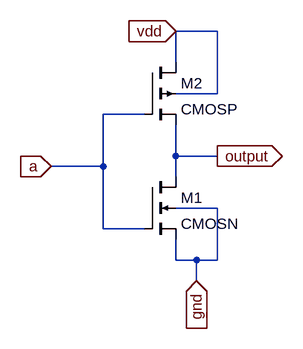
[diagram p0: schematic inveter.asc]
inveter.asc, the LTspice schematic file:
Version 4
SHEET 1 880 680
WIRE -16 -240 -80 -240
WIRE -80 -192 -80 -240
WIRE -16 -144 -16 -240
WIRE -16 -144 -80 -144
WIRE -128 -112 -192 -112
WIRE -80 -48 -80 -96
WIRE -16 -48 -80 -48
WIRE -192 -32 -192 -112
WIRE -192 -32 -272 -32
WIRE -80 -16 -80 -48
WIRE -16 32 -80 32
WIRE -192 64 -192 -32
WIRE -128 64 -192 64
WIRE -80 112 -80 80
WIRE -48 112 -80 112
WIRE -16 112 -16 32
WIRE -16 112 -48 112
WIRE -48 144 -48 112
FLAG -272 -32 a
IOPIN -272 -32 In
FLAG -16 -48 output
IOPIN -16 -48 Out
FLAG -80 -240 vdd
IOPIN -80 -240 In
FLAG -48 144 gnd
IOPIN -48 144 In
SYMBOL cmosn -128 -16 R0
SYMATTR InstName M1
SYMATTR Value2 l=180n w=2u
SYMBOL cmosp -128 -192 R0
SYMATTR InstName M2
SYMATTR Value2 l=180n w=2u

The netlist it stands for:
* inveter.asc
M1 output a gnd gnd CMOSN l=180n w=2u
M2 vdd a output vdd CMOSP l=180n w=2u
.model NMOS NMOS
.model PMOS PMOS
.lib standard.mos
.backanno
.end